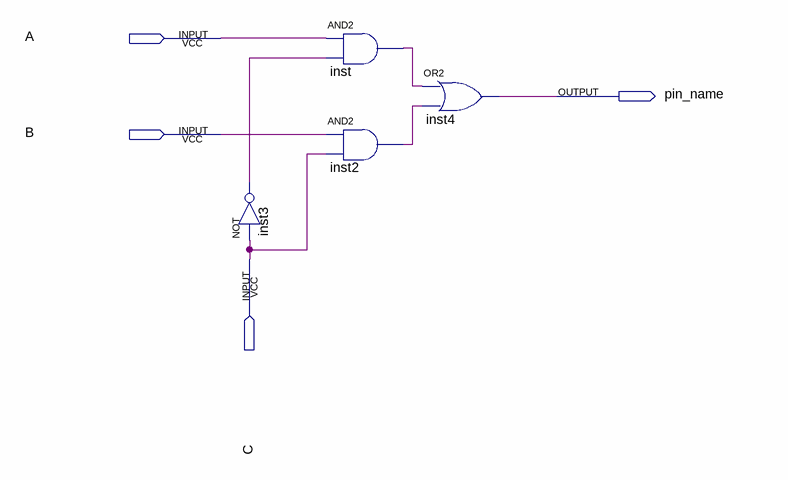
[diagram p0: schematic sheet]
// Quartus schematic MUX2_1.bdf as structural Verilog: 4 symbols, 4 pins
module MUX2_1 (
  input  A,
  input  B,
  input  C,
  output pin_name
);

  wire inst2_out, inst3_out, inst_out;

  not inst3 (inst3_out, C);
  and inst (inst_out, A, inst3_out);
  and inst2 (inst2_out, B, C);
  or inst4 (pin_name, inst_out, inst2_out);
endmodule
